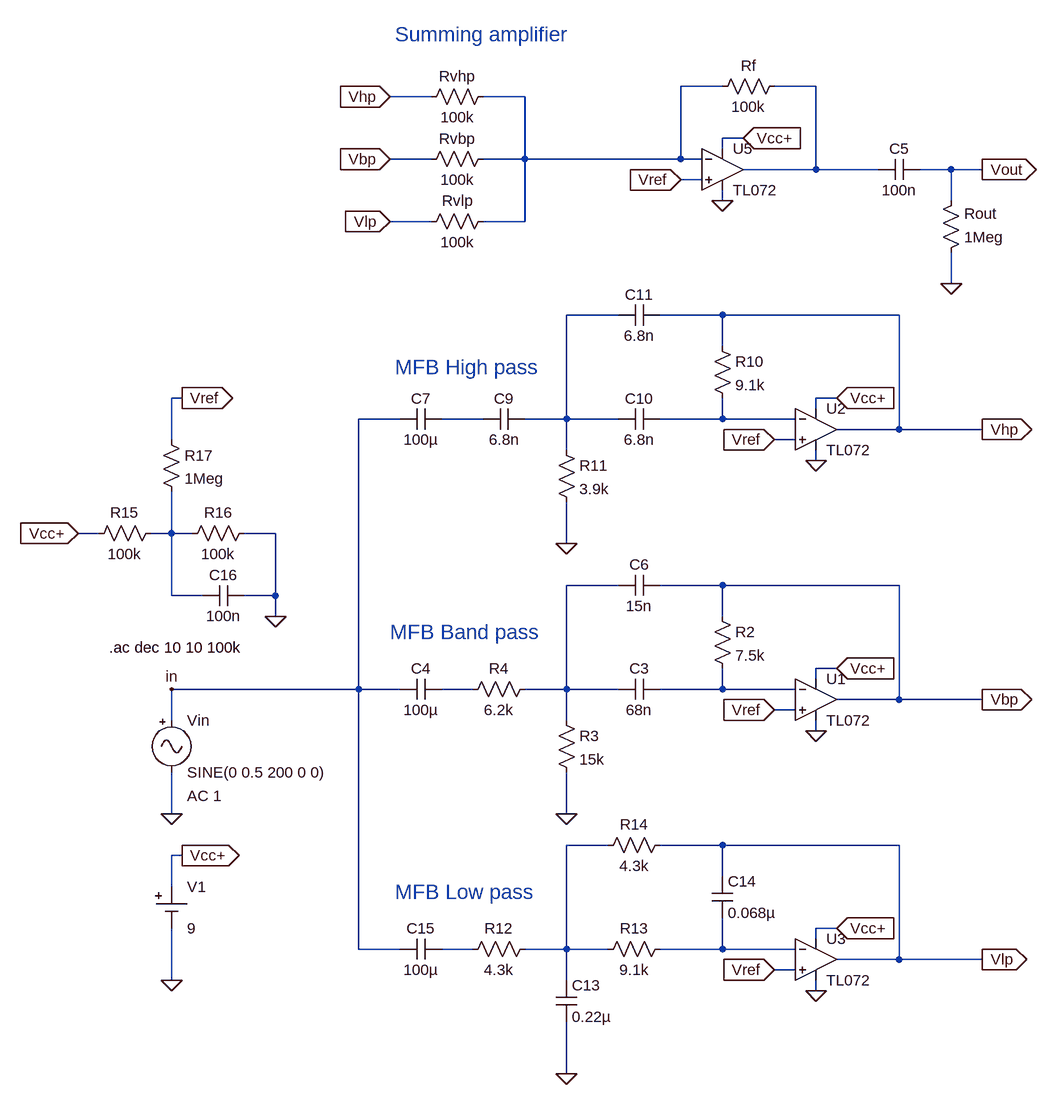
[diagram p0: schematic multiple-feedback-eq.asc]
multiple-feedback-eq.asc, the LTspice schematic file:
Version 4
SHEET 1 1492 1088
WIRE -224 -800 -288 -800
WIRE -80 -800 -144 -800
WIRE -672 -784 -736 -784
WIRE -528 -784 -592 -784
WIRE -192 -720 -224 -720
WIRE -224 -704 -224 -720
WIRE -672 -688 -736 -688
WIRE -528 -688 -528 -784
WIRE -528 -688 -592 -688
WIRE -288 -688 -288 -800
WIRE -288 -688 -528 -688
WIRE -256 -688 -288 -688
WIRE -80 -672 -80 -800
WIRE -80 -672 -192 -672
WIRE 16 -672 -80 -672
WIRE 128 -672 80 -672
WIRE 176 -672 128 -672
WIRE -256 -656 -288 -656
WIRE -224 -624 -224 -640
WIRE 128 -624 128 -672
WIRE -672 -592 -736 -592
WIRE -528 -592 -528 -688
WIRE -528 -592 -592 -592
WIRE 128 -496 128 -544
WIRE -384 -448 -464 -448
WIRE -224 -448 -320 -448
WIRE 48 -448 -224 -448
WIRE -224 -400 -224 -448
WIRE -1056 -320 -1072 -320
WIRE -48 -320 -80 -320
WIRE -80 -304 -80 -320
WIRE -720 -288 -784 -288
WIRE -592 -288 -656 -288
WIRE -464 -288 -464 -448
WIRE -464 -288 -528 -288
WIRE -384 -288 -464 -288
WIRE -224 -288 -224 -320
WIRE -224 -288 -320 -288
WIRE -112 -288 -224 -288
WIRE 48 -272 48 -448
WIRE 48 -272 -48 -272
WIRE 176 -272 48 -272
WIRE -1072 -256 -1072 -320
WIRE -112 -256 -144 -256
WIRE -464 -240 -464 -288
WIRE -80 -224 -80 -240
WIRE -1184 -112 -1216 -112
WIRE -1072 -112 -1072 -176
WIRE -1072 -112 -1104 -112
WIRE -1040 -112 -1072 -112
WIRE -912 -112 -960 -112
WIRE -464 -96 -464 -160
WIRE -384 -32 -464 -32
WIRE -224 -32 -320 -32
WIRE 48 -32 -224 -32
WIRE -1072 -16 -1072 -112
WIRE -1024 -16 -1072 -16
WIRE -912 -16 -912 -112
WIRE -912 -16 -960 -16
WIRE -912 16 -912 -16
WIRE -224 16 -224 -32
WIRE -48 96 -80 96
WIRE -80 112 -80 96
WIRE -784 128 -784 -288
WIRE -784 128 -1072 128
WIRE -720 128 -784 128
WIRE -608 128 -656 128
WIRE -464 128 -464 -32
WIRE -464 128 -528 128
WIRE -384 128 -464 128
WIRE -224 128 -224 96
WIRE -224 128 -320 128
WIRE -112 128 -224 128
WIRE 48 144 48 -32
WIRE 48 144 -48 144
WIRE 176 144 48 144
WIRE -112 160 -144 160
WIRE -1072 176 -1072 128
WIRE -464 176 -464 128
WIRE -80 192 -80 176
WIRE -1072 320 -1072 256
WIRE -464 320 -464 256
WIRE -400 368 -464 368
WIRE -224 368 -320 368
WIRE 48 368 -224 368
WIRE -1056 384 -1072 384
WIRE -224 416 -224 368
WIRE -1072 432 -1072 384
WIRE -48 496 -80 496
WIRE -80 512 -80 496
WIRE -784 528 -784 128
WIRE -720 528 -784 528
WIRE -608 528 -656 528
WIRE -464 528 -464 368
WIRE -464 528 -528 528
WIRE -400 528 -464 528
WIRE -224 528 -224 480
WIRE -224 528 -320 528
WIRE -112 528 -224 528
WIRE 48 544 48 368
WIRE 48 544 -48 544
WIRE 176 544 48 544
WIRE -112 560 -144 560
WIRE -1072 576 -1072 496
WIRE -464 576 -464 528
WIRE -80 592 -80 576
WIRE -464 720 -464 640
FLAG -1072 576 0
FLAG -1056 384 Vcc+
IOPIN -1056 384 Out
FLAG -1072 128 in
FLAG -48 96 Vcc+
IOPIN -48 96 In
FLAG -80 192 0
FLAG -464 320 0
FLAG -1072 320 0
FLAG -48 -320 Vcc+
IOPIN -48 -320 In
FLAG -80 -224 0
FLAG -464 -96 0
FLAG -48 496 Vcc+
IOPIN -48 496 In
FLAG -1216 -112 Vcc+
IOPIN -1216 -112 In
FLAG -80 592 0
FLAG -464 720 0
FLAG -912 16 0
FLAG -1056 -320 Vref
IOPIN -1056 -320 Out
FLAG -144 560 Vref
IOPIN -144 560 In
FLAG -144 160 Vref
IOPIN -144 160 In
FLAG -144 -256 Vref
IOPIN -144 -256 In
FLAG 176 -272 Vhp
IOPIN 176 -272 Out
FLAG 176 144 Vbp
IOPIN 176 144 Out
FLAG 176 544 Vlp
IOPIN 176 544 Out
FLAG -192 -720 Vcc+
IOPIN -192 -720 In
FLAG -224 -624 0
FLAG -288 -656 Vref
IOPIN -288 -656 In
FLAG 128 -496 0
FLAG 176 -672 Vout
IOPIN 176 -672 Out
FLAG -736 -784 Vhp
IOPIN -736 -784 In
FLAG -736 -688 Vbp
IOPIN -736 -688 In
FLAG -736 -592 Vlp
IOPIN -736 -592 In
SYMBOL TL072 -80 80 R0
SYMATTR InstName U1
SYMBOL signal -1072 160 R0
WINDOW 123 24 132 Left 2
WINDOW 39 24 160 Left 2
SYMATTR Value2 AC 1
SYMATTR InstName Vin
SYMATTR Value SINE(0 0.5 200 0 0)
SYMBOL cell -1072 432 R0
WINDOW 123 0 0 Left 2
WINDOW 39 0 0 Left 2
SYMATTR InstName V1
SYMATTR Value 9
SYMBOL cap -656 112 R90
WINDOW 0 0 32 VBottom 2
WINDOW 3 32 32 VTop 2
SYMATTR InstName C4
SYMATTR Value 100µ
SYMBOL res -240 0 R0
SYMATTR InstName R2
SYMATTR Value 7.5k
SYMBOL cap -320 112 R90
WINDOW 0 0 32 VBottom 2
WINDOW 3 32 32 VTop 2
SYMATTR InstName C3
SYMATTR Value 68n
SYMBOL cap -320 -48 R90
WINDOW 0 0 32 VBottom 2
WINDOW 3 32 32 VTop 2
SYMATTR InstName C6
SYMATTR Value 15n
SYMBOL res -480 160 R0
SYMATTR InstName R3
SYMATTR Value 15k
SYMBOL res -512 112 R90
WINDOW 0 0 56 VBottom 2
WINDOW 3 32 56 VTop 2
SYMATTR InstName R4
SYMATTR Value 6.2k
SYMBOL TL072 -80 -336 R0
SYMATTR InstName U2
SYMBOL cap -656 -304 R90
WINDOW 0 0 32 VBottom 2
WINDOW 3 32 32 VTop 2
SYMATTR InstName C7
SYMATTR Value 100µ
SYMBOL res -240 -416 R0
SYMATTR InstName R10
SYMATTR Value 9.1k
SYMBOL cap -528 -304 R90
WINDOW 0 0 32 VBottom 2
WINDOW 3 32 32 VTop 2
SYMATTR InstName C9
SYMATTR Value 6.8n
SYMBOL cap -320 -304 R90
WINDOW 0 0 32 VBottom 2
WINDOW 3 32 32 VTop 2
SYMATTR InstName C10
SYMATTR Value 6.8n
SYMBOL cap -320 -464 R90
WINDOW 0 0 32 VBottom 2
WINDOW 3 32 32 VTop 2
SYMATTR InstName C11
SYMATTR Value 6.8n
SYMBOL res -480 -256 R0
SYMATTR InstName R11
SYMATTR Value 3.9k
SYMBOL TL072 -80 480 R0
SYMATTR InstName U3
SYMBOL res -624 544 R270
WINDOW 0 32 56 VTop 2
WINDOW 3 0 56 VBottom 2
SYMATTR InstName R12
SYMATTR Value 4.3k
SYMBOL res -416 544 R270
WINDOW 0 32 56 VTop 2
WINDOW 3 0 56 VBottom 2
SYMATTR InstName R13
SYMATTR Value 9.1k
SYMBOL res -416 384 R270
WINDOW 0 32 56 VTop 2
WINDOW 3 0 56 VBottom 2
SYMATTR InstName R14
SYMATTR Value 4.3k
SYMBOL cap -480 576 R0
SYMATTR InstName C13
SYMATTR Value 0.22µ
SYMBOL cap -240 416 R0
SYMATTR InstName C14
SYMATTR Value 0.068µ
SYMBOL res -1200 -96 R270
WINDOW 0 32 56 VTop 2
WINDOW 3 0 56 VBottom 2
SYMATTR InstName R15
SYMATTR Value 100k
SYMBOL res -1056 -96 R270
WINDOW 0 32 56 VTop 2
WINDOW 3 0 56 VBottom 2
SYMATTR InstName R16
SYMATTR Value 100k
SYMBOL cap -656 512 R90
WINDOW 0 0 32 VBottom 2
WINDOW 3 32 32 VTop 2
SYMATTR InstName C15
SYMATTR Value 100µ
SYMBOL cap -1024 0 R270
WINDOW 0 32 32 VTop 2
WINDOW 3 0 32 VBottom 2
SYMATTR InstName C16
SYMATTR Value 100n
SYMBOL res -1088 -272 R0
SYMATTR InstName R17
SYMATTR Value 1Meg
SYMBOL TL072 -224 -736 R0
SYMATTR InstName U5
SYMBOL res -240 -784 R270
WINDOW 0 32 56 VTop 2
WINDOW 3 0 56 VBottom 2
SYMATTR InstName Rf
SYMATTR Value 100k
SYMBOL cap 80 -688 R90
WINDOW 0 0 32 VBottom 2
WINDOW 3 32 32 VTop 2
SYMATTR InstName C5
SYMATTR Value 100n
SYMBOL res 112 -528 M180
WINDOW 0 36 76 Left 2
WINDOW 3 36 40 Left 2
SYMATTR InstName Rout
SYMATTR Value 1Meg
SYMBOL res -688 -768 R270
WINDOW 0 32 56 VTop 2
WINDOW 3 0 56 VBottom 2
SYMATTR InstName Rvhp
SYMATTR Value 100k
SYMBOL res -688 -672 R270
WINDOW 0 32 56 VTop 2
WINDOW 3 0 56 VBottom 2
SYMATTR InstName Rvbp
SYMATTR Value 100k
SYMBOL res -688 -576 R270
WINDOW 0 32 56 VTop 2
WINDOW 3 0 56 VBottom 2
SYMATTR InstName Rvlp
SYMATTR Value 100k
TEXT -1168 64 Left 2 !.ac dec 10 10 100k
TEXT -736 40 Left 3 ;MFB Band pass
TEXT -728 -368 Left 3 ;MFB High pass
TEXT -728 440 Left 3 ;MFB Low pass
TEXT -728 -880 Left 3 ;Summing amplifier

The netlist it stands for:
* multiple-feedback-eq.asc
* U1: TL072 (symbol TL072 not available, pins judged from their places): In+=Vref In-=N009 V+=Vcc+ V-=0 OUT=Vbp
Vin in 0 SINE(0 0.5 200 0 0) AC 1
V1 Vcc+ 0 9
C4 N008 in 100µ
R2 Vbp N009 7.5k
C3 N009 N007 68n
C6 Vbp N007 15n
R3 N007 0 15k
R4 N007 N008 6.2k
* U2: TL072 (symbol TL072 not available, pins judged from their places): In+=Vref In-=N005 V+=Vcc+ V-=0 OUT=Vhp
C7 N004 in 100µ
R10 Vhp N005 9.1k
C9 N003 N004 6.8n
C10 N005 N003 6.8n
C11 Vhp N003 6.8n
R11 N003 0 3.9k
* U3: TL072 (symbol TL072 not available, pins judged from their places): In+=Vref In-=N012 V+=Vcc+ V-=0 OUT=Vlp
R12 N011 N010 4.3k
R13 N010 N012 9.1k
R14 N010 Vlp 4.3k
C13 N010 0 0.22µ
C14 Vlp N012 0.068µ
R15 Vcc+ N006 100k
R16 N006 0 100k
C15 N011 in 100µ
C16 N006 0 100n
R17 Vref N006 1Meg
* U5: TL072 (symbol TL072 not available, pins judged from their places): In+=Vref In-=N001 V+=Vcc+ V-=0 OUT=N002
Rf N001 N002 100k
C5 Vout N002 100n
Rout 0 Vout 1Meg
Rvhp Vhp N001 100k
Rvbp Vbp N001 100k
Rvlp Vlp N001 100k
.ac dec 10 10 100k
* MFB Band pass
* MFB High pass
* MFB Low pass
* Summing amplifier
.backanno
.end